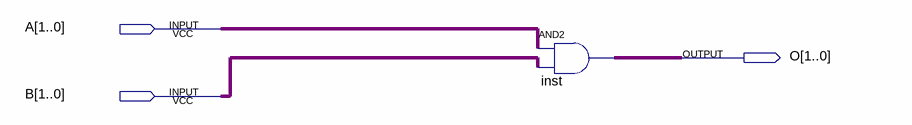
[diagram p0: schematic sheet]
// Quartus schematic gate_on_buses.bdf as structural Verilog: 1 symbols, 3 pins
module gate_on_buses (
  input  [1:0] A,
  input  [1:0] B,
  output [1:0] O
);

  assign O = A & B;  // AND2 inst, 2 bits wide
endmodule
